# EAGLE design Smartwatch-PPG-Module (EAGLE 9.6.2)
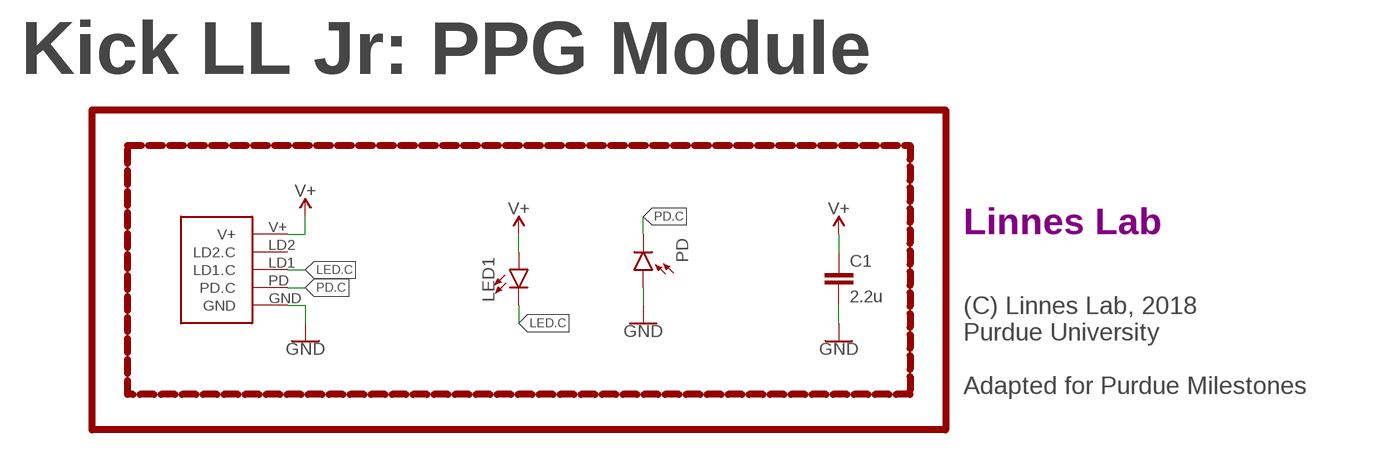
[diagram p0: schematic, sheet 1]

## Parts
C1  2.2u  CAPACITOR0603  [C0603]
J1  PPG.MODULE.2  [PPG.MODULE.2]
LED1  LED0805  [LED-0805]
PD  PHOTODIODE.-SMD.GULLWING  [2-SMD.GULLWING]
U$3  LINNES.LAB.LOGO  [LINNES.LAB.LOGO]

## Nets
GND: C1.2 J1.GND PD.+(A)
LED.C: J1.LD1(LD1.C) LED1.C
PD.C: J1.PD(PD.C) PD.-(C)
V+: C1.1 J1.V+ LED1.A
Unconnected: J1.LD2(LD2.C)

## Notes on the sheet
- Kick LL Jr: PPG Module
- (C) Linnes Lab, 2018
  Purdue University
  
  Adapted for Purdue Milestones

## Library data of the parts
C1 = CalvEngIO-Passives:CAPACITOR
J1 = LinnesLab-Connectors:PPG.MODULE.2: Digi-Key Part Number: S9014E-50-ND Manufacturer Part Number: GRPB501VWVN-RC Description: 1mm insulation height 0.05in pitch 50 positions
LED1 = LinnesLab-LED:LED: LED (Generic) Standard schematic elements and footprints for 5mm, 3mm, 1206, and 0603 sized LEDs. Generic LEDs with no color specified. LTST-C190KGKT: arrow indicates cathode
PD = CalvEngIO-Sensors:PHOTODIODE
U$3 = CalvEngIO-Logos:LINNES.LAB

## Board
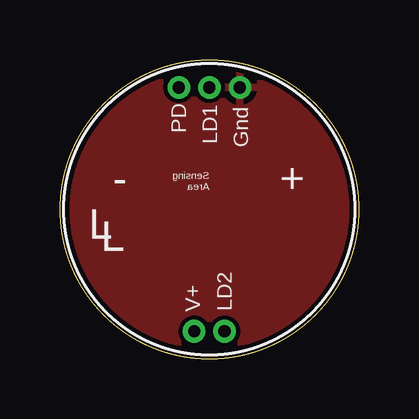
[diagram p1: board, top side]
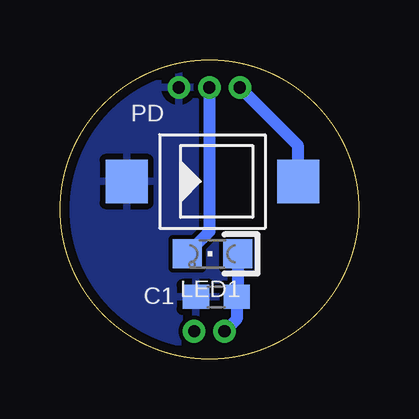
[diagram p2: board, bottom side, seen from below]

Size 12.45 x 12.45 mm. Coordinates in mm from the lower left corner, seen from the top.
Outline: circle at 6.22,6.22 radius 6.22
Copper layers (1*16): Top 0.0356mm / dielectric 1.5011mm / Bottom 0.0356mm
Design rules "PCBWay-Safe": minimum track width 6mil, minimum drill 12mil, track to track 6mil, track to pad 6mil, pad to pad 6mil, via to via 6mil, smd to smd 6mil, copper to edge 15mil, drill to drill 6mil, minimum pad ring 7mil, minimum via ring 7mil, stop-mask expansion 3mil, vias tented up to drill 0mil, thermal gap 10mil

### Footprints (pad centres in the part's own frame; a part is rotated, then mirrored left to right if it is on the bottom)
C0603 = smd 1.1 x 1: 1 -0.85,0; 2 0.85,0
PPG.MODULE.2 = drill 0.508 pad 0.94: GND 1.27,5.08; LD1 0,5.08; LD2 0.635,-5.08; PD -1.27,5.08; V+ -0.635,-5.08
LED-0805 = smd 1.2 x 1.2: A 0,-1.05; C 0,1.05
2-SMD.GULLWING = smd 1.75 x 1.8: + -3.575,0; - 3.575,0

### Placement (x,y rotation side)
C1  5.93,2.58 180 bottom
J1  6.22,6.22 0 top
LED1  6.1,4.37 90 bottom
PD  6.1,7.39 0 bottom
U$3  1.19,4.98 0 top

### Tracks (layer width: path | path; a pad name or v marks a point on that pad's centre or on a via)
GND
  pour Bottom (isolate 0.178): -11.98,23.02 22.67,23.02 22.67,-11.24 -11.95,-11.24
  pour Top (isolate 0.178): 23.63,22.69 23.63,-11.8 -11.09,-11.8 -11.09,22.69
LED.C
  Bottom 0.508: J1.LD1 6.22,5.29 LED1.C
PD.C
  Bottom 0.508: PD.- 2.52,8.87 J1.PD
V+
  Bottom 0.508: LED1.A 5.04,2.58 C1.1 5.08,1.65 J1.V+